# EAGLE design can (EAGLE 9.1.1)
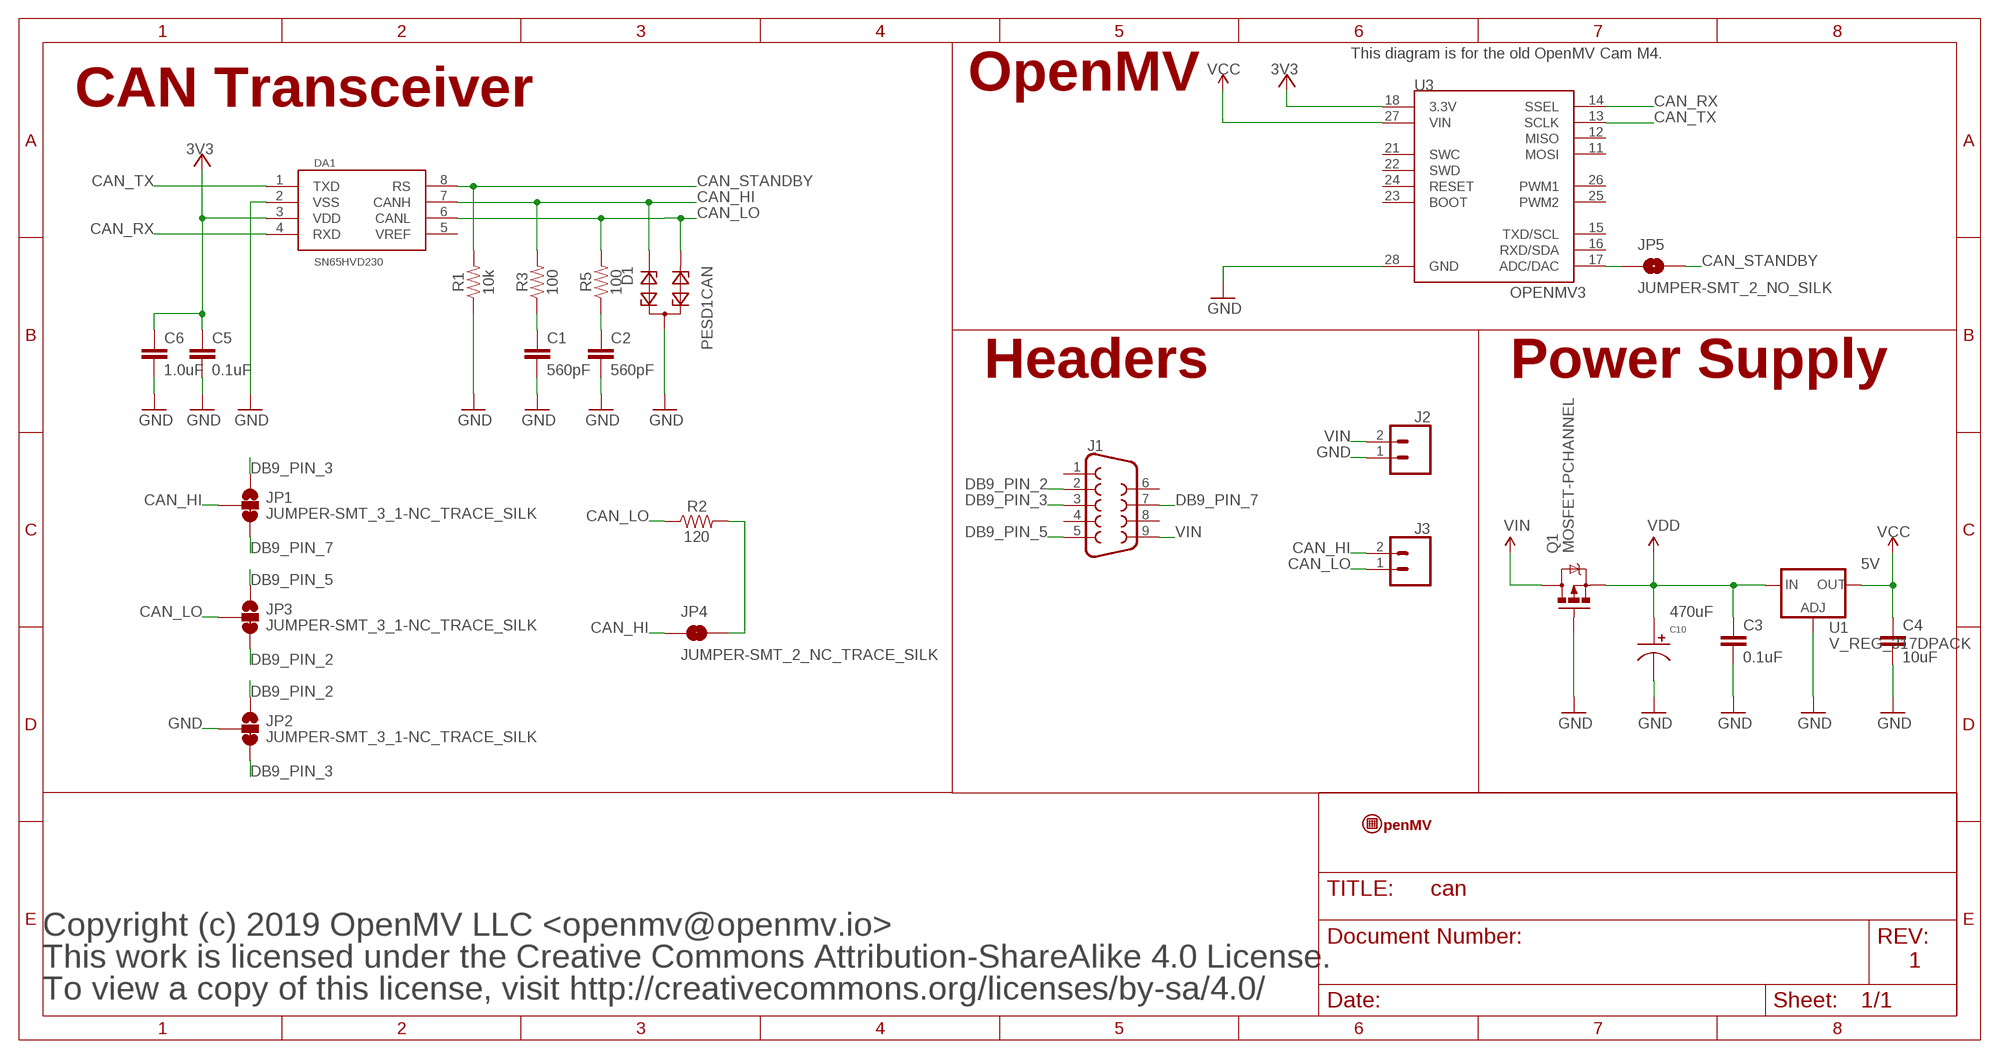
[diagram p0: schematic, sheet 1]

## Parts
C1  560pF  560PF-0603-50V-5%  [0603]
C2  560pF  560PF-0603-50V-5%  [0603]
C3  0.1uF  CAP0603-CAP  [0603-CAP]
C4  10uF  CAP0805  [0805]
C5  0.1uF  0.1UF-0603-25V-(+80/-20%)  [0603]
C6  1.0uF  1.0UF-0603-16V-10%  [0603]
C10  CAPACITOR_P_10MM  [CP10MM]
D1  PESD1CAN  [SOT23]
DA1  SN65HVD230  [SO08]
J1  DB9MALE  [DB9_MALE]
J2  CONN_02  [1X02]
J3  CONN_02  [1X02]
JP1  JUMPER-SMT_3_1-NC_TRACE_SILK  [SMT-JUMPER_3_1-NC_TRACE_SILK]
JP2  JUMPER-SMT_3_1-NC_TRACE_SILK  [SMT-JUMPER_3_1-NC_TRACE_SILK]
JP3  JUMPER-SMT_3_1-NC_TRACE_SILK  [SMT-JUMPER_3_1-NC_TRACE_SILK]
JP4  JUMPER-SMT_2_NC_TRACE_SILK  [SMT-JUMPER_2_NC_TRACE_SILK]
JP5  JUMPER-SMT_2_NO_SILK  [SMT-JUMPER_2_NO_SILK]
Q1  MOSFET-PCHANNEL  [SOT23-3]
R1  10k  10KOHM-0603-1/10W-1%  [0603]
R2  120  100OHM-0603-1/10W-1%  [0603]
R3  100  100OHM-0603-1/10W-1%  [0603]
R5  100  100OHM-0603-1/10W-1%  [0603]
U1  V_REG_317DPACK  [V-REG_DPACK]
U3  OPENMV3  [OPENMV3]
U$9  OPENMV-LOGO  [OPENMV-LOGO]

## Nets
3V3: C5.1 C6.1 DA1.3(VDD) U3.18(3.3V)
CAN_HI: D1.1 DA1.7(CANH) J3.2 JP1.2 JP4.1 R3.2
CAN_HI_BALANCE: C1.1 R3.1
CAN_LO: D1.2 DA1.6(CANL) J3.1 JP3.2 R2.1 R5.2
CAN_LO_BALANCE: C2.1 R5.1
CAN_RX: DA1.4(RXD) U3.14(SSEL)
CAN_STANDBY: DA1.8(RS) JP5.2 R1.2
CAN_TX: DA1.1(TXD) U3.13(SCLK)
DB9_PIN_2: J1.2 JP2.1 JP3.3
DB9_PIN_3: J1.3 JP1.1 JP2.3
DB9_PIN_5: J1.5 JP3.1
DB9_PIN_7: J1.7 JP1.3
GND: C1.2 C2.2 C3.2 C4.2 C5.2 C6.2 C10.P$2 D1.3 DA1.2(VSS) J2.1 JP2.2 Q1.1(G) R1.1 U1.1(ADJ) U3.28(GND)
OPENMV_STANDBY: JP5.1 U3.17(ADC/DAC)
TERM: JP4.2 R2.2
VCC: C4.1 U1.4(OUT) U3.27(VIN)
VDD: C3.1 C10.P$1 Q1.2(S) U1.3(IN)
VIN: J1.9 J2.2 Q1.3(D)
Unconnected: DA1.5(VREF) J1.1 J1.4 J1.6 J1.8 U3.11(MOSI) U3.12(MISO) U3.15(TXD/SCL) U3.16(RXD/SDA) U3.21(SWC) U3.22(SWD) U3.23(BOOT) U3.24(RESET) U3.25(PWM2) U3.26(PWM1)

## Notes on the sheet
- This diagram is for the old OpenMV Cam M4.
- CAN Transceiver | OpenMV
- Headers | Power Supply
- 5V
- 470uF
- Copyright (c) 2019 OpenMV LLC <openmv@openmv.io>
- This work is licensed under the Creative Commons Attribution-ShareAlike 4.0 License. | 1
- To view a copy of this license, visit http://creativecommons.org/licenses/by-sa/4.0/

## Library data of the parts
C1 C2 = SparkFun-Capacitors:560PF: 0.56nF/560pF ceramic capacitors A capacitor is a passive two-terminal electrical component used to store electrical energy temporarily in an electric field.; PROD_ID: CAP-08749
C3 C4 = sfe:CAP: Capacitor Standard 0603 ceramic capacitor, and 0.1" leaded capacitor.
C5 = SparkFun-Capacitors:0.1UF: 0.1µF ceramic capacitors A capacitor is a passive two-terminal electrical component used to store electrical energy temporarily in an electric field.; PROD_ID: CAP-00810
C6 = SparkFun-Capacitors:1.0UF: 1µF ceramic capacitors A capacitor is a passive two-terminal electrical component used to store electrical energy temporarily in an electric field.; PROD_ID: CAP-00868
C10 = MF_Passives:CAPACITOR_P: Library: MF_Passives Description: Device for Polarized Capacitors. Manufacture part number (MFG#), Voltage Rating, and Tolerance can be added via Attributes.; MGF#: N/A; TOLERANCE: N/A; VOLTAGE: N/A
D1 = diode:PESD1CAN: CAN bus ESD protection diode Source: http://www.nxp.com/documents/data_sheet/PESD1CAN.pdf
DA1 = can_driver:SN65HVD230: CAN PHY driver 3.3-V CAN TRANSCEIVERS
J1 = SparkFun-Connectors:DB9: DB9 Connector Standard DB9 (D-Sub 9) serial connector. Can be used for CAN bus as well as RS485 and RS232. Footprint production proven. Here is the female version connector we sell at SparkFun: 9 Pin Female Serial Connector - PCB Mount <https://www.sparkfun.com/products/429> (PRT-00429) This connector has been used on the following SparkFun products: SparkFun RS232 Shifter - SMD <https://www.sparkfun.com/products/449> (PRT-00449) SparkFun RS232 Shifter SMD (No DB9) <https://www.sparkfun.com/products/8780> (PRT-08780); PROD_ID: CONN-09904
J2 J3 = SparkFun-Connectors:CONN_02: Multi connection point. Often used as Generic Header-pin footprint for 0.1 inch spaced/style header connections On any of the 0.1 inch spaced packages, you can populate with these: Break Away Headers - Straight <https://www.sparkfun.com/products/116> (PRT-00116) Break Away Male Headers - Right Angle <https://www.sparkfun.com/products/553> (PRT-00553) Female Headers <https://www.sparkfun.com/products/115> (PRT-00115) Break Away Headers - Machine Pin <https://www.sparkfun.com/products/117> (PRT-00117) Break Away Female Headers - Swiss Machine Pin <https://www.sparkfun.com/products/743> (PRT-00743) For SCREWTERMINALS and SPRING TERMINALS visit here: Screw Terimnals on SparkFun.com <https://www.sparkfun.com/search/results?term=Screw+Terminals> (5mm/3.5mm/2.54mm spacing) This device is also useful as a general connection point to wire up your design to another part of your project. Our various solder wires solder well into these plated through hole pads. Hook-Up Wire - Assortment (Stranded, 22 AWG) <https://www.sparkfun.com/products/11375> (PRT-11375) Hook-Up Wire - Assortment (Solid Core, 22 AWG) <https://www.sparkfun.com/products/11367> (PRT-11367) View the entire wire category on our website here <https://www.sparkfun.com/categories/141> Special notes: Molex polarized connector foot print use with: PRT-08233 with associated crimp pins and housings. 2.54_SCREWTERM for use with PRT-10571. 3.5mm Screw Terminal footprints for PRT-08084 5mm Screw Terminal footprints for use with PRT-08432
JP1-JP3 = SparkFun-Jumpers:JUMPER-SMT_3_1-NC_TRACE: Normally closed trace jumper (1 of 2 connections) This jumper has a trace between two pads so it's normally closed (NC). The other connection is normally open (NO). Use a razor knife to open the connection. For best results follow the IPC guidelines for cutting traces: Cutout at least 0.063 mm (0.005 in). Remove all loose material to clean up the cut area. Seal the cut with an approved epoxy. Reapply solder to reclose the connection, or to close the NO connection.
JP4 = SparkFun-Jumpers:JUMPER-SMT_2_NC_TRACE: Normally closed trace jumper This jumper has a trace between two pads so it's normally closed (NC). Use a razor knife to open the connection. For best results follow the IPC guidelines for cutting traces: Cutout at least 0.063 mm (0.005 in). Remove all loose material to clean up the cut area. Seal the cut with an approved epoxy. Reapply solder to reclose the connection.
JP5 = SparkFun-Jumpers:JUMPER-SMT_2_NO: Normally open jumper This jumper has two pads in close proximity to each other. Apply solder to close the connection. Round pads are easier to solder for beginners, but are a lot larger. SparkFun Product that uses the round pads: SparkFun EL Sequencer <https://www.sparkfun.com/products/12781>
Q1 = SparkFun-DiscreteSemi:MOSFET-PCHANNEL: Generic PMOSFET IRLML2244 - TRANS-11153 (SOT-23 -20V -4.3A) (1.Gate 2.Source 3.Drain) FQP27P06 - COM-10349 <http://www.sparkfun.com/products/10349> (TO-220 -60V -27A) (1.Gate 2.Source 3.Drain); PROD_ID: TRANS-08285
R1 = SparkFun-Resistors:10KOHM: 10kΩ resistor A resistor is a passive two-terminal electrical component that implements electrical resistance as a circuit element. Resistors act to reduce current flow, and, at the same time, act to lower voltage levels within circuits. - Wikipedia; PROD_ID: RES-00824
R2 = SparkFun-Resistors:100OHM: 100Ω resistor A resistor is a passive two-terminal electrical component that implements electrical resistance as a circuit element. Resistors act to reduce current flow, and, at the same time, act to lower voltage levels within circuits. - Wikipedia; PROD_ID: RES-07863; VALUE: 100
R3 R5 = SparkFun-Resistors:100OHM: 100Ω resistor A resistor is a passive two-terminal electrical component that implements electrical resistance as a circuit element. Resistors act to reduce current flow, and, at the same time, act to lower voltage levels within circuits. - Wikipedia; PROD_ID: RES-07863
U1 = SparkFun-PowerIC:V_REG_317: Voltage Regulator Standard LM317 adjustable voltage regulator. AOI (Adjust Output Input). Google 'LM317 Calculator' for easy to use app to get the two resistor values needed. 240/720 for 5V output. 240/390 for 3.3V output. Spark Fun Electronics SKU : COM-00527; PROD_ID: IC-09888
U3 = openmv:OPENMV3
U$9 = openmv:OPENMV-LOGO

## Net classes
1 vcc: width 1.016 mm, clearance 0.203 mm
2 antenna: width 0.363 mm, clearance 0.305 mm
3 1.8v: width 0.457 mm, clearance 0.254 mm

## Board
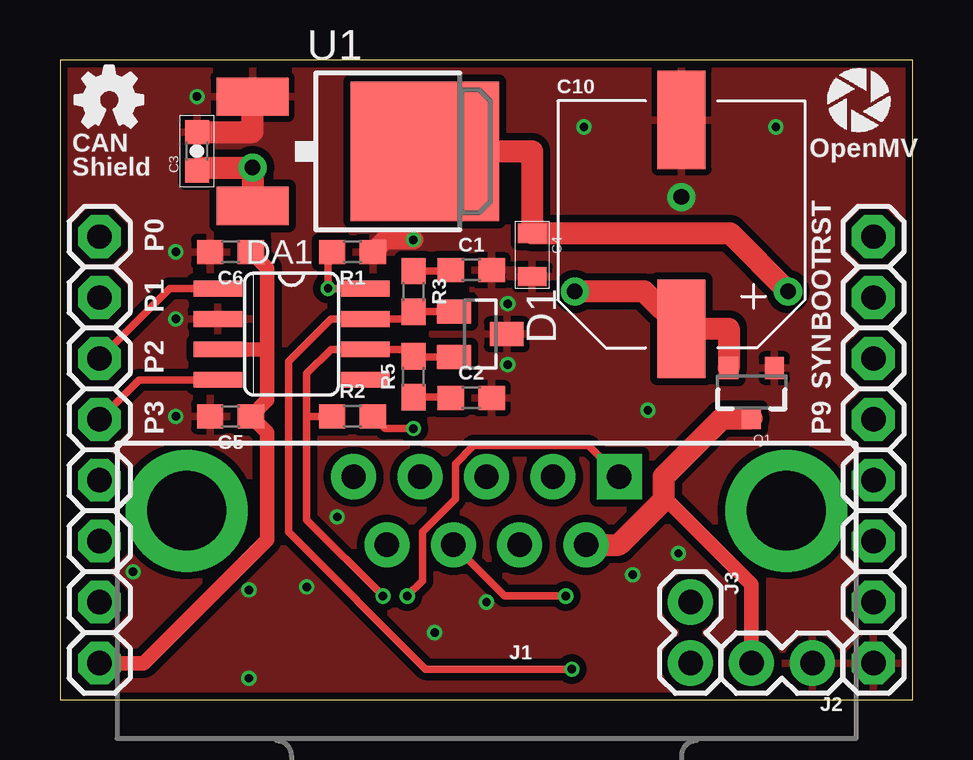
[diagram p1: board, top side]
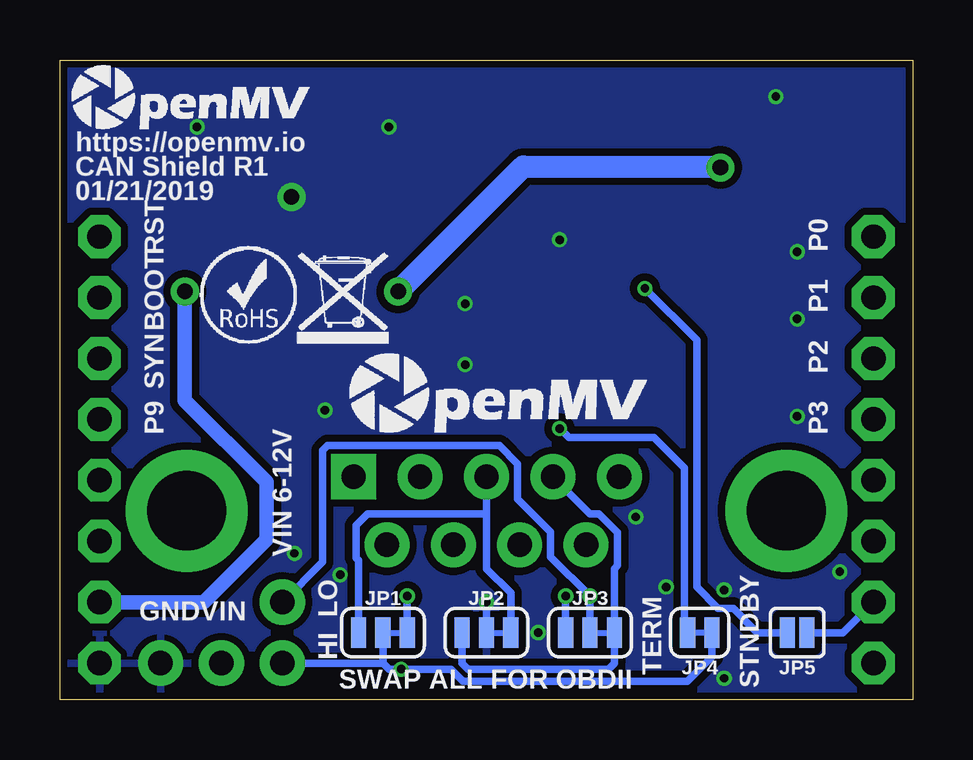
[diagram p2: board, bottom side, seen from below]

Size 35.56 x 26.67 mm. Coordinates in mm from the lower left corner, seen from the top.
Outline: 0,0 35.56,0 35.56,26.67 0,26.67 0,0
Copper layers (1*16): Top 0.035mm / dielectric 1.5mm / Bottom 0.035mm
Design rules "openmv3 *": minimum track width 5mil, minimum drill 10mil, track to track 8mil, track to pad 8mil, pad to pad 8mil, via to via 8mil, smd to smd 8mil, copper to edge 5mil, drill to drill 10mil, minimum pad ring 10mil, minimum via ring 4mil, stop-mask expansion 2mil, vias tented up to drill 30mil, thermal gap 10mil

### Footprints (pad centres in the part's own frame; a part is rotated, then mirrored left to right if it is on the bottom)
0603 = smd 1.1 x 1: 1 -0.85,0; 2 0.85,0
0603-CAP = smd 1 x 1: 1 -0.8,0; 2 0.8,0
0805 = smd 0.8 x 1.2: 1 -0.9,0; 2 0.9,0
CP10MM = smd 2 x 4.1: P$1 0,-4.35; P$2 0,4.35
SOT23 = smd 1 x 1.4: 1 -0.95,-1.1; 2 0.95,-1.1; 3 0,1.1
SO08 = smd 0.66 x 2.032: 1 -1.905,-3.073; 2 -0.635,-3.073; 3 0.635,-3.073; 4 1.905,-3.073; 5 1.905,3.073; 6 0.635,3.073; 7 -0.635,3.073; 8 -1.905,3.073
DB9_MALE = drill 1.016 pad 1.88: 1 5.54,-1.42; 2 2.77,-1.42; 3 0,-1.42; 4 -2.77,-1.42; 6 4.15,1.42; 7 1.38,1.42; 8 -1.38,1.42; 9 -4.15,1.42 | drill 1.016 pad 1.88 square: 5 -5.54,-1.42 | drill 3.302 pad 5.08: G1 -12.5,0; G2 12.5,0
1X02 = drill 1.016 pad 1.88: 1 0,0; 2 2.54,0
SMT-JUMPER_3_1-NC_TRACE_SILK = smd 0.635 x 1.27: 1 -1.016,0; 2 0,0; 3 1.016,0
SMT-JUMPER_2_NC_TRACE_SILK = smd 0.635 x 1.27: 1 -0.508,0; 2 0.508,0
SMT-JUMPER_2_NO_SILK = smd 0.635 x 1.27: 1 -0.406,0; 2 0.406,0
SOT23-3 = smd 0.8 x 0.9: 1 -0.95,-1; 2 0.95,-1; 3 0,1.1
V-REG_DPACK = smd 1.6 x 3: 1 -2.28,-4.8; 3 2.28,-4.8 | smd 5.8 x 6.2: 4 0,2.38
OPENMV3 = drill 1.016 pad 1.778 octagon: 11 1.651,19.304; 12 1.651,16.764; 13 1.651,14.224; 14 1.651,11.684; 15 1.651,9.144; 16 1.651,6.604; 17 1.651,4.064; 18 1.651,1.524; 21 33.909,19.304; 22 33.909,16.764; 23 33.909,14.224; 24 33.909,11.684; 25 33.909,9.144; 26 33.909,6.604; 27 33.909,4.064; 28 33.909,1.524

### Placement (x,y rotation side)
C1  17.14,17.91 0 top
C2  17.14,12.57 0 top
C3  5.71,22.86 90 top
C4  19.68,18.54 270 top
C5  7.11,11.81 180 top
C6  7.11,18.67 180 top
C10  25.91,19.81 0 top
D1  17.53,15.24 270 top
DA1  9.65,15.24 270 top
J1  17.78,7.87 180 top
J2  31.37,1.52 180 top
J3  26.29,4.06 270 top
JP1  22.1,2.79 0 bottom
JP2  17.78,2.79 0 bottom
JP3  13.46,2.79 0 bottom
JP4  8.89,2.79 180 bottom
JP5  4.83,2.79 180 bottom
Q1  28.83,12.83 180 top
R1  12.19,18.67 180 top
R2  12.19,11.81 0 top
R3  14.73,17.02 270 top
R5  14.73,13.46 90 top
U1  12.83,22.86 270 top
U3  0,0 0 top
U$3  [OMV-LOGO]  23.62,10.92 0 bottom
U$5  [ROHS]  29.72,14.86 0 bottom
U$6  [WEEE]  25.65,14.86 0 bottom
U$9  31.88,23.5 0 top
U$10  [OMV-LOGO-SMALL]  35.18,23.62 0 bottom
U$11  [OSHW_FILLX100_NOTEXT]  0.64,23.88 0 top

### Tracks (layer width: path | path; a pad name or v marks a point on that pad's centre or on a via)
3V3
  Top 0.61: C6.1 8.64,18 8.64,14.61 | 8.64,14.61 8.64,12.48 C5.1 8.64,11.14 8.64,6.67 3.5,1.52 U3.18 | DA1.3 8.64,14.61
CAN_HI  (via drill 0.35)
  Top 0.305: v21.34,1.27 15.24,1.27 9.53,6.99 9.53,14.1 11.3,15.88 DA1.7 14.44,15.88 R3.2 14.75,16.19 D1.1
  Bottom 0.305: JP4.1 8.38,1.78 9.4,0.76 18.75,0.76 19.26,1.27 v21.34,1.27 21.84,1.27 22.1,1.52 | JP1.2 22.1,1.52 | J3.2 22.1,1.52
CAN_HI_BALANCE
  Top 0.305: R3.1 16.26,17.87 C1.1
CAN_LO  (via drill 0.35)
  Top 0.305: v13.46,4.32 10.29,7.49 10.29,11.81 | 10.29,11.81 10.29,13.59 11.3,14.61 DA1.6 14.44,14.61 14.65,14.39 | 14.65,14.39 R5.2 | D1.2 14.75,14.29 14.65,14.39 | R2.1 10.29,11.81
  Bottom 0.305: JP3.2 v13.46,4.32 15.11,5.96 15.11,6.99 16.48,8.37 16.48,9.83 17.24,10.59 24.41,10.59 24.61,10.38 24.61,5.74 J3.1
CAN_LO_BALANCE
  Top 0.305: R5.1 16.26,12.61 C2.1
CAN_RX
  Top 0.305: U3.14 3.3,13.34 DA1.4
CAN_STANDBY  (via drill 0.35)
  Top 0.305: DA1.8 v11.18,17.14 11.18,18.5 R1.2
  Bottom 0.305: JP5.2 6.48,2.79 7.49,3.81 8.13,3.81 9.02,4.7 9.02,14.99 v11.18,17.14
CAN_TX
  Top 0.305: DA1.1 4.57,17.14 U3.13
DB9_PIN_2
  Bottom 0.305: JP2.1 18.8,1.52 18.54,1.27 12.7,1.27 12.45,1.52 JP3.3 12.45,5.46 12.32,5.59 12.32,6.97 13.09,7.75 13.46,7.75 J1.2
DB9_PIN_3
  Bottom 0.305: JP2.3 16.76,4.45 17.78,5.46 17.78,7.75 | 17.78,7.75 J1.3 | JP1.1 23.11,5.81 23.23,5.92 23.23,7.25 22.73,7.75 18.62,7.75 17.78,7.75
DB9_PIN_5  (via drill 0.35)
  Top 0.305: v14.48,4.32 15.11,4.95 15.11,6.99 16.48,8.37 16.48,9.83 17.24,10.59 22.02,10.59 J1.5
  Bottom 0.305: JP3.1 v14.48,4.32
DB9_PIN_7  (via drill 0.35)
  Top 0.305: v21.08,4.32 18.54,4.32 J1.7
  Bottom 0.305: JP1.3 v21.08,4.32
GND  (via drill 0.35, 0.65)
  Top 0.813: R1.1 13.55,19.18 v14.73,19.18
  Top 0.914: C3.2 8.03,23.66 U1.1
  Bottom 0.305: JP2.2 v17.78,4.06
  other vias: 4.83,18.67 4.83,11.81 4.83,15.88 18.67,16.51 18.67,13.97 25.91,20.95 10.29,4.7 11.56,7.62 7.87,0.89 24.51,12.06 21.84,23.88 29.84,23.88 7.87,4.57 3.05,5.33 15.62,2.79 23.88,5.21 25.78,6.1 5.71,25.15
  pour Bottom (isolate 0.305): 0,0 35.56,0 35.56,26.67 0,26.67
  pour Top (isolate 0.305): 0,0 35.56,0 35.56,26.67 0,26.67
OPENMV_STANDBY
  Bottom 0.305: U3.17 2.92,2.79 JP5.1
TERM  (via drill 0.35)
  Top 0.305: v14.73,11.3 13.55,11.3 R2.2
  Bottom 0.305: v14.73,11.3 14.35,10.92 10.79,10.92 9.53,9.65 9.53,2.92 JP4.2
VCC  (via drill 0.65)
  Top 0.914: U1.4 19.68,22.86 C4.1 27.93,19.44 v30.35,17.02
  Bottom 0.61: v30.35,17.02 30.35,12.47 26.95,9.07 26.95,6.67 29.56,4.06 U3.27
VDD  (via drill 0.65)
  Top 0.914: Q1.2 27.88,15.46 C10.P$1 24.35,17.02 v21.46,17.02 | U1.3 v8.03,22.19 5.84,22.19 C3.1
  Bottom 0.914: v21.46,17.02 16.26,22.23 7.99,22.23 v8.03,22.19
VIN
  Top 0.61: J2.2 28.83,4.81 25.17,8.46
  Top 0.914: J1.9 23.29,6.45 25.17,8.34 25.17,8.46 25.17,9.3 27.6,11.73 Q1.3

### Text on the board
tPlace: OpenMV | CAN / Shield | P0 | RST | P1 | BOOT | P2 | SYN | P3 | P9
bPlace: https://openmv.io | CAN Shield R1 | 01/21/2019 | P0 | RST | P1 | BOOT | P2 | SYN | P3 | P9 | VIN 6-12V | STNDBY | TERM | LO | VIN | GND | HI | SWAP ALL FOR OBDII